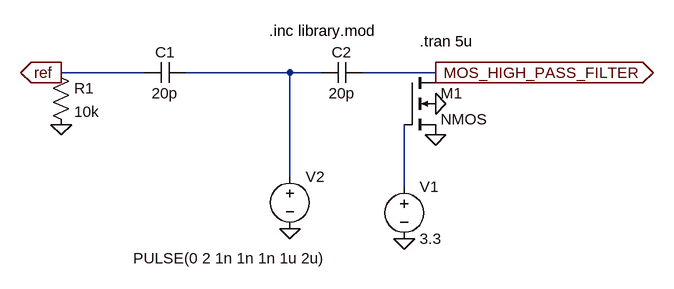
[diagram p0: schematic Draft2.asc]
Draft2.asc, the LTspice schematic file:
Version 4
SHEET 1 880 680
WIRE -176 112 -304 112
WIRE 48 112 -112 112
WIRE 96 112 48 112
WIRE 272 112 160 112
WIRE 48 272 48 112
WIRE 224 288 224 192
FLAG 272 160 0
FLAG 272 208 0
FLAG -304 192 0
FLAG 48 352 0
FLAG 224 368 0
FLAG 272 112 MOS_HIGH_PASS_FILTER
IOPIN 272 112 Out
FLAG -304 112 ref
IOPIN -304 112 Out
SYMBOL res -320 96 R0
SYMATTR InstName R1
SYMATTR Value 10k
SYMBOL voltage 224 272 R0
WINDOW 123 0 0 Left 0
WINDOW 39 0 0 Left 0
SYMATTR InstName V1
SYMATTR Value 3.3
SYMBOL voltage 48 256 R0
WINDOW 3 -241 142 Left 2
WINDOW 123 0 0 Left 0
WINDOW 39 0 0 Left 0
SYMATTR Value PULSE(0 2 1n 1n 1n 1u 2u)
SYMATTR InstName V2
SYMBOL nmos4 224 112 R0
SYMATTR InstName M1
SYMATTR Value2 l=0.9u w=0.35u
SYMBOL cap -112 96 R90
WINDOW 0 0 32 VBottom 2
WINDOW 3 32 32 VTop 2
SYMATTR InstName C1
SYMATTR Value 20p
SYMBOL cap 160 96 R90
WINDOW 0 0 32 VBottom 2
WINDOW 3 32 32 VTop 2
SYMATTR InstName C2
SYMATTR Value 20p
TEXT 16 48 Left 2 !.inc library.mod
TEXT 248 64 Left 2 !.tran 5u

The netlist it stands for:
* Draft2.asc
R1 ref 0 10k
V1 N002 0 3.3
V2 N001 0 PULSE(0 2 1n 1n 1n 1u 2u)
M1 MOS_HIGH_PASS_FILTER N002 0 0 NMOS l=0.9u w=0.35u
C1 N001 ref 20p
C2 MOS_HIGH_PASS_FILTER N001 20p
.model NMOS NMOS
.model PMOS PMOS
.lib standard.mos
.inc library.mod
.tran 5u
.backanno
.end